# EAGLE design smart-plug (EAGLE 9.1.3)
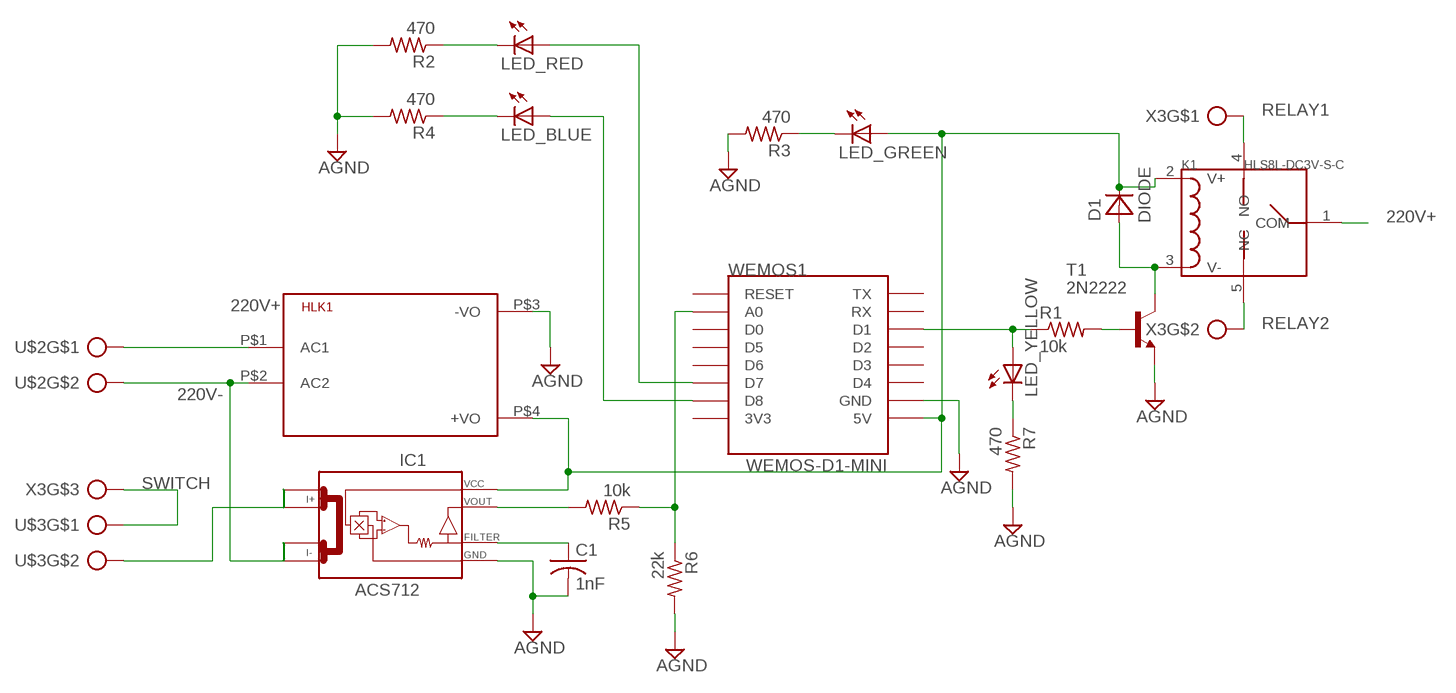
[diagram p0: schematic, sheet 1]

## Parts
C1  1nF  C-USC1206  [C1206]
D1  DIODE  [DO41-10]
HLK1  HLK-SUPPLY  [HLK-PM01]
IC1  ACS712  [SO08]
K1  HLS8L-DC3V-S-C  RELAY  [REY5-19.0X15.0X15.0MM]
LED_BLUE  LEDCHIP-LED0805  [CHIP-LED0805]
LED_GREEN  LEDCHIP-LED0805  [CHIP-LED0805]
LED_RED  LEDCHIP-LED0805  [CHIP-LED0805]
LED_YELLOW  LEDCHIP-LED0805  [CHIP-LED0805]
R1  10k  R-US_R1206  [R1206]
R2  470  R-US_R1206  [R1206]
R3  470  R-US_R1206  [R1206]
R4  470  R-US_R1206  [R1206]
R5  10k  R-US_R1206  [R1206]
R6  22k  R-US_R1206  [R1206]
R7  470  R-US_R1206  [R1206]
T1  2N2222  [TO92-EBC-OVAL]
U$2  OUT-2PINS  [AK300/2]
U$3  OUT-2PINS  [AK300/2]
WEMOS1  WEMOS-D1-MINI  [WEMOS-D1-MINI]
X3  OUT-3PINS  [AK300/3]

## Nets
220V+: HLK1.P$1(AC1) K1.1(COM) U$2.1
220V-: HLK1.P$2(AC2) IC1.4(I-_1) U$2.2
AGND: C1.2 HLK1.P$3(-VO) IC1.5(GND) R2.2 R3.2 R4.2 R6.2 R7.2 T1.E WEMOS1.GND
LED_BLUE: LED_BLUE.A WEMOS1.D8
LED_GREEN: LED_GREEN.C R3.1
LED_GREEN1: LED_YELLOW.C R7.1
LED_RED: LED_RED.A WEMOS1.D7
N$1: IC1.2(I+_1) U$3.2
N$2: LED_YELLOW.A R1.1 WEMOS1.D1
N$3: R1.2 T1.B
N$4: D1.C HLK1.P$4(+VO) IC1.8(VCC) K1.2(V+) LED_GREEN.A WEMOS1.5V
N$5: C1.1 IC1.6(FILTER)
N$6: D1.A K1.3(V-) T1.C
N$7: IC1.7(VOUT) R5.2
N$8: R5.1 R6.1 WEMOS1.A0
N$9: LED_RED.C R2.1
N$10: LED_BLUE.C R4.1
RELAY1: K1.4(NO) X3.1
RELAY2: K1.5(NC) X3.2
SWITCH: U$3.1 X3.3
Unconnected: IC1.1(I+_0) IC1.3(I-_0) WEMOS1.3V3 WEMOS1.D0 WEMOS1.D2 WEMOS1.D3 WEMOS1.D4 WEMOS1.D5 WEMOS1.D6 WEMOS1.RESET WEMOS1.RX WEMOS1.TX

## Library data of the parts
C1 = adafruit:C-US: CAPACITOR, American symbol
D1 = smartplug-components:DIODE
HLK1 = smartplug-components:HLK-SUPPLY
IC1 = ACS712:ACS712
K1 = smartplug-components:RELAY
LED_BLUE LED_GREEN LED_RED LED_YELLOW = adafruit:LED: LED OSRAM: - CHIPLED LG R971, LG N971, LY N971, LG Q971, LY Q971, LO R971, LY R971 LH N974, LH R974 LS Q976, LO Q976, LY Q976 LO Q996 - Hyper CHIPLED LW Q18S LB Q993, LB Q99A, LB R99A - SideLED LS A670, LO A670, LY A670, LG A670, LP A670 LB A673, LV A673, LT A673, LW A673 LH A674 LY A675 LS A676, LA A676, LO A676, LY A676, LW A676 LS A679, LY A679, LG A679 - Hyper Micro SIDELED® LS Y876, LA Y876, LO Y876, LY Y876 LT Y87S - SmartLED LW L88C, LW L88S LB L89C, LB L89S, LG L890 LS L89K, LO L89K, LY L89K LS L896, LA L896, LO L896, LY L896 - TOPLED LS T670, LO T670, LY T670, LG T670, LP T670 LSG T670, LSP T670, LSY T670, LOP T670, LYG T670 LG T671, LOG T671, LSG T671 LB T673, LV T673, LT T673, LW T673 LH T674 LS T676, LA T676, LO T676, LY T676, LB T676, LH T676, LSB T676, LW T676 LB T67C, LV T67C, LT T67C, LS T67K, LO T67K, LY T67K, LW E67C LS E67B, LA E67B, LO E67B, LY E67B, LB E67C, LV E67C, LT E67C LW T67C LS T679, LY T679, LG T679 LS T770, LO T770, LY T770, LG T770, LP T770 LB T773, LV T773, LT T773, LW T773 LH T774 LS E675, LA E675, LY E675, LS T675 LS T776, LA T776, LO T776, LY T776, LB T776 LHGB T686 LT T68C, LB T68C - Hyper Mini TOPLED® LB M676 - Mini TOPLED Santana® LG M470 LS M47K, LO M47K, LY M47K Source: http://www.osram.convergy.de/
R1-R7 = adafruit:R-US_: RESISTOR, American symbol
T1 = adafruit:2N2222: NPN TRANSISTOR Big oval pads
U$2 U$3 = smartplug-components:OUT-2PINS
WEMOS1 = smartplug-components:WEMOS-D1-MINI
X3 = smartplug-components:OUT-3PINS

## Board
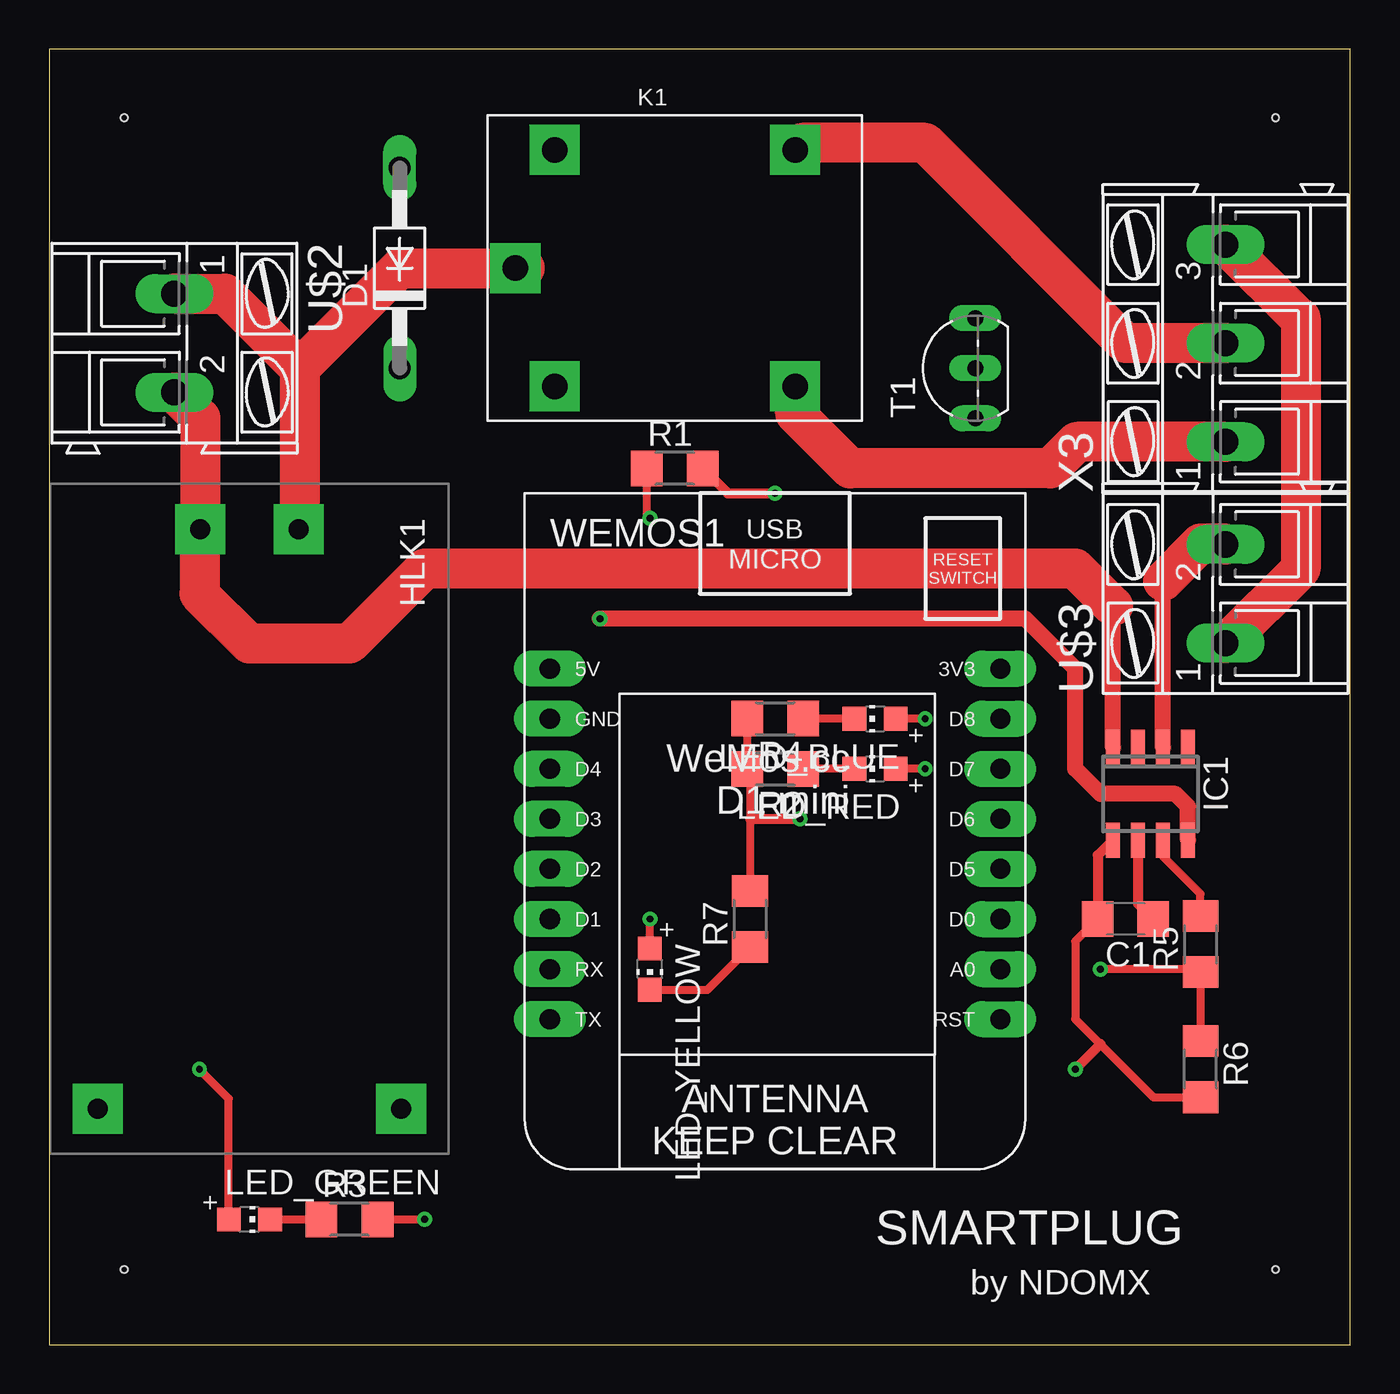
[diagram p1: board, top side]
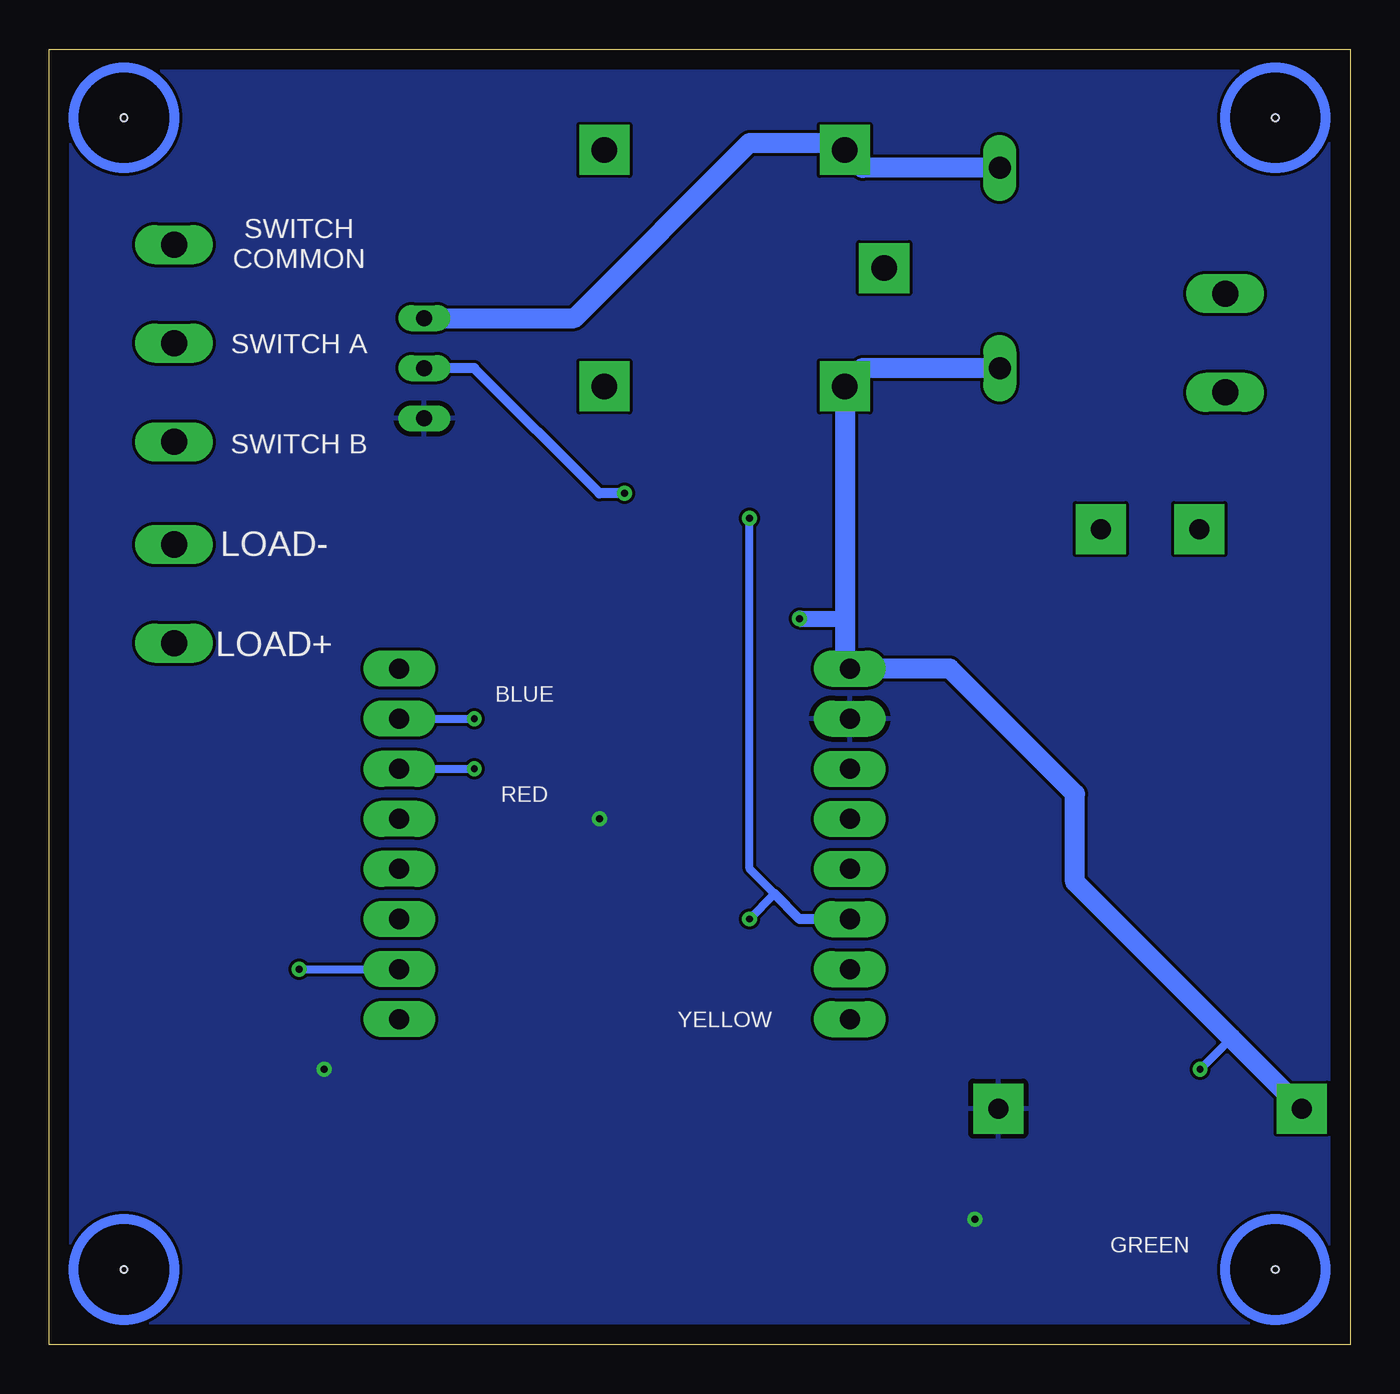
[diagram p2: board, bottom side, seen from below]

Size 66.02 x 65.71 mm. Coordinates in mm from the lower left corner, seen from the top.
Outline: 0,0 66.02,0 66.02,65.71 0,65.71 0,0
Copper layers (1*16): Top 0.035mm / dielectric 1.5mm / Bottom 0.035mm
Design rules "default": minimum track width 6mil, minimum drill 0.35mm, track to track 6mil, track to pad 6mil, pad to pad 6mil, via to via 6mil, smd to smd 6mil, copper to edge 40mil, drill to drill 6mil, minimum pad ring 10mil, minimum via ring 8mil, stop-mask expansion 4mil, vias tented up to drill 0mil, thermal gap 10mil
Holes 0.35 mm at 3.81,62.23 3.81,3.81 62.23,3.81 62.23,62.23

### Footprints (pad centres in the part's own frame; a part is rotated, then mirrored left to right if it is on the bottom)
C1206 = smd 1.6 x 1.8: 1 -1.4,0; 2 1.4,0
DO41-10 = drill 1.118 pad 1.676 long: A 5.08,0; C -5.08,0
HLK-PM01 = drill 1.016 pad 2.54 square: P$1 -14.7,2.5; P$2 -14.7,-2.5; P$3 14.7,7.7; P$4 14.7,-7.7
SO08 = smd 0.72 x 1.78: 1 -1.905,-2.35; 2 -0.635,-2.35; 3 0.635,-2.35; 4 1.905,-2.35; 5 1.905,2.35; 6 0.635,2.35; 7 -0.635,2.35; 8 -1.905,2.35
REY5-19.0X15.0X15.0MM = drill 1.3 pad 2.54 square: 1 -8.1,0; 2 -6.1,-6; 3 -6.1,6; 4 6.1,-6; 5 6.1,6
CHIP-LED0805 = smd 1.2 x 1.2: A 0,-1.05; C 0,1.05
R1206 = smd 1.6 x 1.803: 1 -1.422,0; 2 1.422,0
TO92-EBC-OVAL = drill 0.813 long: B 0,-1.27; C 2.54,-1.27; E -2.54,-1.27
AK300/2 = drill 1.321 long: 1 -2.515,0; 2 2.489,0
WEMOS-D1-MINI = drill 1.016 pad 1.829 long: 3V3 -10.16,-10.16; 5V 12.7,-10.16; A0 -10.16,5.08; D0 -10.16,2.54; D1 12.7,2.54; D2 12.7,0; D3 12.7,-2.54; D4 12.7,-5.08; D5 -10.16,0; D6 -10.16,-2.54; D7 -10.16,-5.08; D8 -10.16,-7.62; GND 12.7,-7.62; RESET -10.16,7.62; RX 12.7,5.08; TX 12.7,7.62
AK300/3 = drill 1.321 long: 1 -5.004,0; 2 0,0; 3 5.004,0

### Placement (x,y rotation side)
C1  54.61,21.59 180 top
D1  17.78,54.61 90 top
HLK1  10.16,26.67 270 top
IC1  55.88,27.94 180 top
K1  31.75,54.61 0 top
LED_BLUE  41.91,31.75 90 top
LED_GREEN  10.16,6.35 270 top
LED_RED  41.91,29.21 90 top
LED_YELLOW  30.48,19.05 180 top
R1  31.75,44.45 0 top
R2  36.83,29.21 180 top
R3  15.24,6.35 0 top
R4  36.83,31.75 180 top
R5  58.42,20.32 90 top
R6  58.42,13.97 270 top
R7  35.56,21.59 90 top
T1  45.72,49.53 90 top
U$2  6.35,50.8 270 top
U$3  59.69,38.1 90 top
WEMOS1  38.1,24.13 180 top
X3  59.69,50.8 90 top

### Tracks (layer width: path | path; a pad name or v marks a point on that pad's centre or on a via)
220V+
  Top 2.032: U$2.1 8.91,53.31 12.7,49.53 | 12.7,49.53 12.7,41.41 HLK1.P$1 | 12.7,49.53 17.78,54.61 K1.1 | K1.1 24.13,54.61 K1.1
220V-
  Top 0.813: IC1.4 53.98,37.47
  Top 2.032: U$2.2 7.66,47 HLK1.P$2 7.66,38.14 7.62,38.1 10.16,35.56 15.24,35.56 19.05,39.37 52.07,39.37 53.98,37.47
AGND  (via drill 0.35)
  Top 0.406: R4.2 R2.2 35.56,29.06 35.56,26.67 R7.2 | R3.2 v19.05,6.35 | C1.2 52.07,20.45 52.07,16.51 53.34,15.24 56.03,12.55 R6.2
  Top 0.508: IC1.5 53.21,24.82 C1.2 | 35.56,26.67 v38.1,26.67 | 53.34,15.24 v52.07,13.97
  pour Bottom: -3.81,69.85 69.85,69.85 69.85,-2.54 -5.08,-2.54 -5.08,69.85
LED_BLUE  (via drill 0.35)
  Top 0.406: v44.45,31.75 LED_BLUE.A
  Bottom 0.406: WEMOS1.D8 v44.45,31.75
LED_GREEN
  Top 0.406: LED_GREEN.C R3.1
LED_GREEN1
  Top 0.406: LED_YELLOW.C 33.39,18 R7.1
LED_RED  (via drill 0.35)
  Top 0.406: v44.45,29.21 LED_RED.A
  Bottom 0.406: WEMOS1.D7 v44.45,29.21
N$1
  Top 0.813: IC1.2 56.52,38.73
  Top 2.032: 56.52,38.73 58.42,40.64 59.64,40.64 U$3.2
N$2  (via drill 0.35)
  Top 0.406: v30.48,41.91 30.33,42.06 R1.1 | LED_YELLOW.A v30.48,21.59
  Bottom 0.406: v30.48,41.91 30.48,24.13 29.21,22.86 v30.48,21.59
  Bottom 0.508: WEMOS1.D1 27.94,21.59 29.21,22.86
N$3  (via drill 0.35)
  Top 0.508: R1.2 34.44,43.18 v36.83,43.18
  Bottom 0.508: T1.B 44.45,49.53 38.1,43.18 v36.83,43.18
N$4  (via drill 0.35)
  Top 0.406: LED_GREEN.A 9.11,12.48 v7.62,13.97
  Top 0.813: IC1.8 57.78,27.3 57.15,27.94 53.34,27.94 52.07,29.21 52.07,34.29 49.53,36.83 v27.94,36.83
  Bottom 0.406: v7.62,13.97 6.04,15.55
  Bottom 0.813: v27.94,36.83 25.65,36.83
  Bottom 1.016: D1.C 24.73,49.53 K1.2 25.65,36.83 25.65,34.54 WEMOS1.5V 20.32,34.29 13.97,27.94 13.97,23.48 6.04,15.55 HLK1.P$4
N$5
  Top 0.508: IC1.6 55.25,22.36 C1.1
N$6
  Bottom 1.016: T1.C 39.37,52.07 30.48,60.96 26,60.96 K1.3 24.73,59.69 D1.A
N$7
  Top 0.406: IC1.7 56.52,24.77 58.42,22.86 R5.2
N$8  (via drill 0.35)
  Top 0.406: R6.1 R5.1 58.27,19.05 v53.34,19.05
  Bottom 0.406: v53.34,19.05 WEMOS1.A0
N$9
  Top 0.406: LED_RED.C R2.1
N$10
  Top 0.406: LED_BLUE.C R4.1
RELAY1
  Top 2.032: X3.1 52.15,45.8 50.8,44.45 40.64,44.45 37.85,47.24 K1.4
RELAY2
  Top 2.032: K1.5 38.2,60.96 44.45,60.96 54.61,50.8 X3.2
SWITCH
  Top 2.032: X3.3 63.42,52.07 63.5,52.07 63.5,39.37 59.72,35.59 U$3.1
(copper drawn outside any net)
  shapes: Bottom circle x4

### Text on the board
tPlace: SMARTPLUG | by NDOMX
bNames: SWITCH / COMMON | SWITCH A | SWITCH B | LOAD- | LOAD+ | BLUE | RED | YELLOW | GREEN